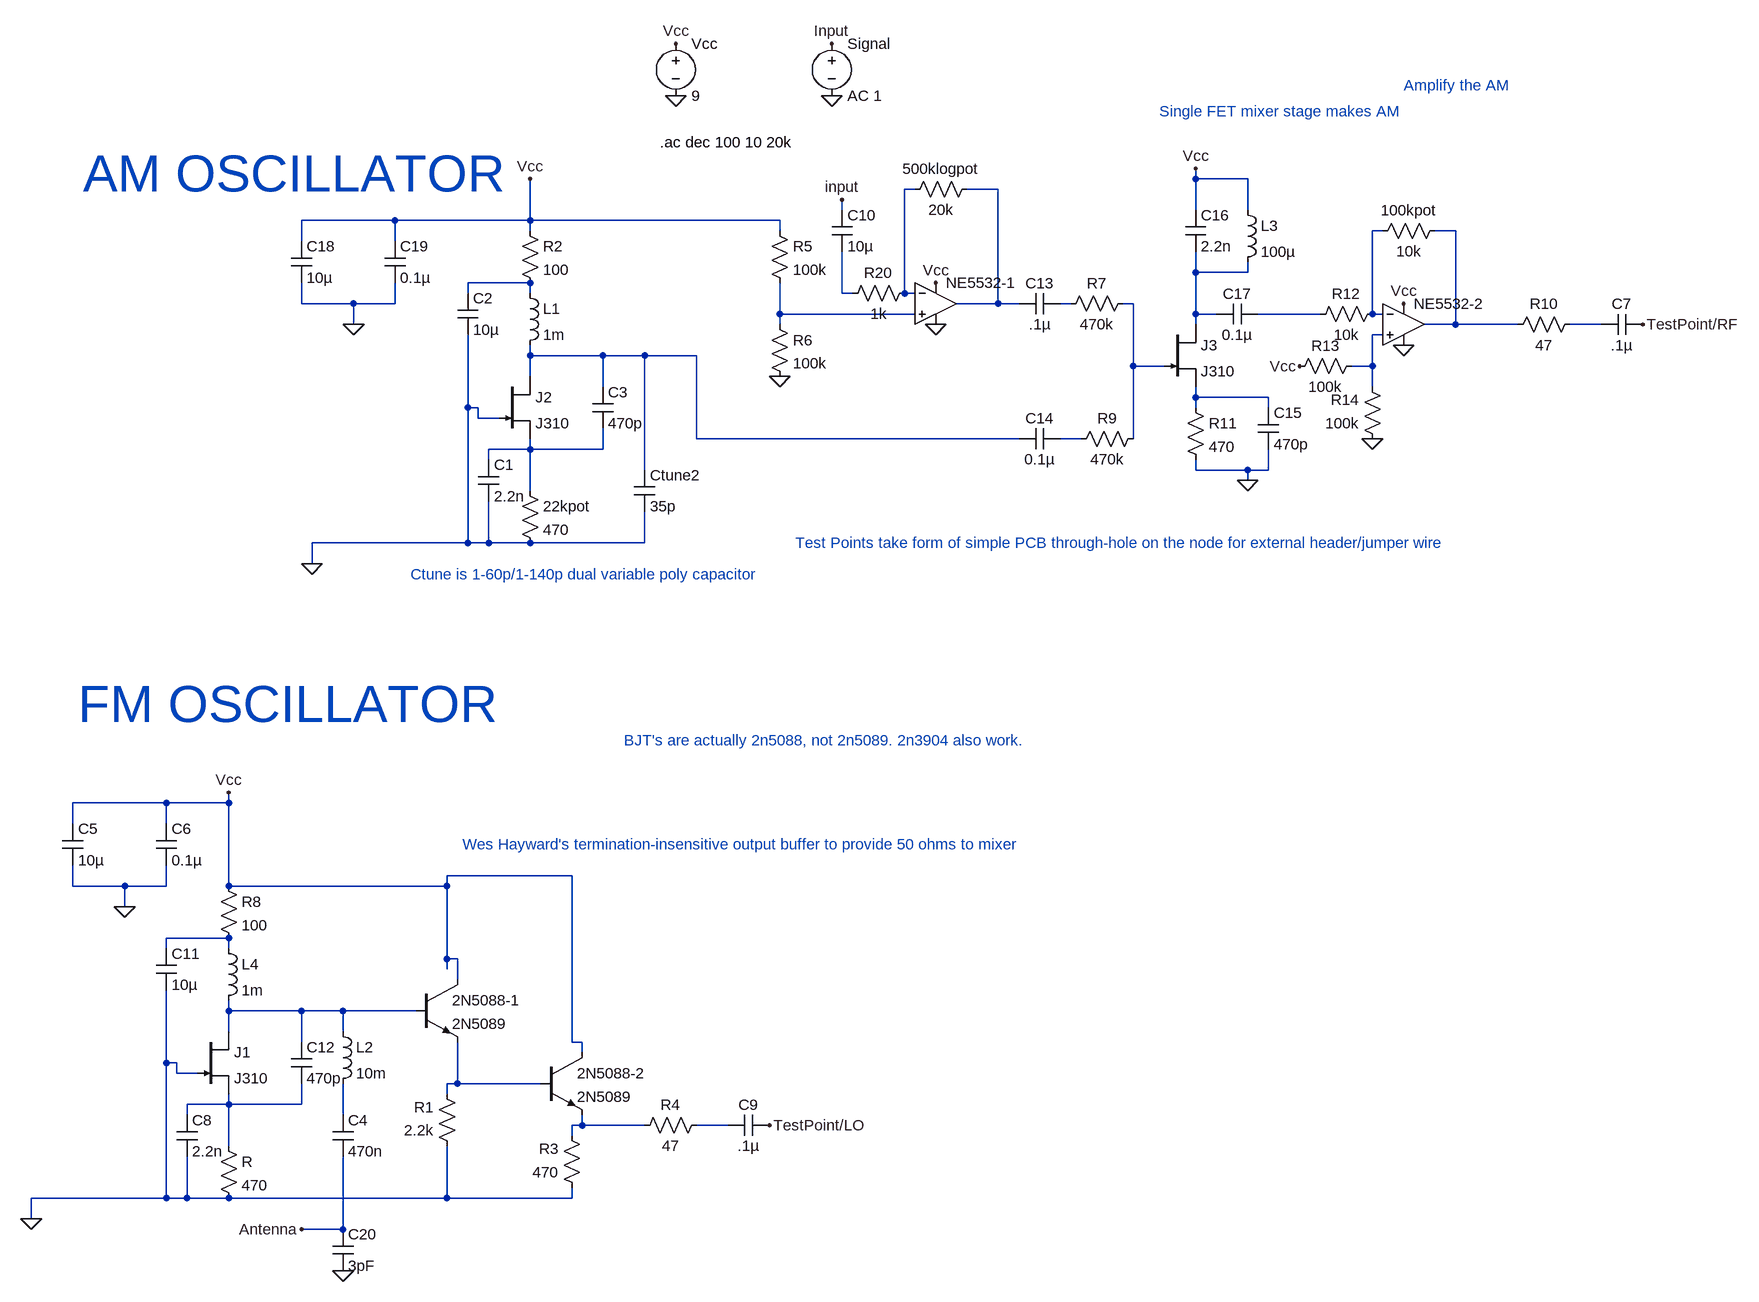
[diagram p0: schematic Theremizer.asc]
Theremizer.asc, the LTspice schematic file:
Version 4
SHEET 1 1160 2132
WIRE -256 -176 -256 -192
WIRE -176 -176 -256 -176
WIRE -688 -160 -704 -160
WIRE -560 -160 -608 -160
WIRE -800 -128 -800 -144
WIRE -256 -128 -256 -176
WIRE -176 -128 -176 -176
WIRE -1488 -112 -1632 -112
WIRE -1280 -112 -1280 -176
WIRE -1280 -112 -1488 -112
WIRE -896 -112 -1280 -112
WIRE -1280 -96 -1280 -112
WIRE -896 -96 -896 -112
WIRE 32 -96 16 -96
WIRE 144 -96 112 -96
WIRE -1632 -80 -1632 -112
WIRE -1488 -80 -1488 -112
WIRE -256 -32 -256 -64
WIRE -176 -32 -176 -48
WIRE -176 -32 -256 -32
WIRE -1280 -16 -1376 -16
WIRE -1376 0 -1376 -16
WIRE -1280 0 -1280 -16
WIRE -800 0 -800 -64
WIRE -784 0 -800 0
WIRE -704 0 -704 -160
WIRE -688 0 -704 0
WIRE -1632 16 -1632 -16
WIRE -1552 16 -1632 16
WIRE -1488 16 -1488 -16
WIRE -1488 16 -1552 16
WIRE -560 16 -560 -160
WIRE -560 16 -624 16
WIRE -528 16 -560 16
WIRE -448 16 -464 16
WIRE -352 16 -368 16
WIRE -896 32 -896 -16
WIRE -688 32 -896 32
WIRE -256 32 -256 -32
WIRE -224 32 -256 32
WIRE -64 32 -160 32
WIRE 16 32 16 -96
WIRE 32 32 16 32
WIRE -1552 48 -1552 16
WIRE -896 48 -896 32
WIRE -256 48 -256 32
WIRE 144 48 144 -96
WIRE 144 48 96 48
WIRE 240 48 144 48
WIRE 368 48 320 48
WIRE 32 64 16 64
WIRE -1280 96 -1280 80
WIRE -1168 96 -1280 96
WIRE -1104 96 -1168 96
WIRE -1024 96 -1104 96
WIRE -352 112 -352 16
WIRE -304 112 -352 112
WIRE 16 112 16 64
WIRE 16 112 -16 112
WIRE -1280 128 -1280 96
WIRE -1168 144 -1168 96
WIRE 16 144 16 112
WIRE -256 160 -256 144
WIRE -144 160 -256 160
WIRE -1376 176 -1376 64
WIRE -1360 176 -1376 176
WIRE -256 176 -256 160
WIRE -144 176 -144 160
WIRE -1360 192 -1360 176
WIRE -1328 192 -1360 192
WIRE -1024 224 -1024 96
WIRE -528 224 -1024 224
WIRE -432 224 -464 224
WIRE -352 224 -352 112
WIRE -1280 240 -1280 224
WIRE -1280 240 -1344 240
WIRE -1168 240 -1168 208
WIRE -1168 240 -1280 240
WIRE -1344 256 -1344 240
WIRE -1104 272 -1104 96
WIRE -256 272 -256 256
WIRE -176 272 -256 272
WIRE -144 272 -144 240
WIRE -144 272 -176 272
WIRE -176 288 -176 272
WIRE -1280 304 -1280 240
WIRE -1376 384 -1376 176
WIRE -1376 384 -1616 384
WIRE -1344 384 -1344 320
WIRE -1344 384 -1376 384
WIRE -1280 384 -1344 384
WIRE -1104 384 -1104 336
WIRE -1104 384 -1280 384
WIRE -1616 416 -1616 384
WIRE -1840 784 -1984 784
WIRE -1744 784 -1744 768
WIRE -1744 784 -1840 784
WIRE -1984 816 -1984 784
WIRE -1840 816 -1840 784
WIRE -1216 896 -1408 896
WIRE -1984 912 -1984 880
WIRE -1904 912 -1984 912
WIRE -1840 912 -1840 880
WIRE -1840 912 -1904 912
WIRE -1744 912 -1744 784
WIRE -1408 912 -1408 896
WIRE -1408 912 -1744 912
WIRE -1904 944 -1904 912
WIRE -1744 992 -1840 992
WIRE -1840 1008 -1840 992
WIRE -1744 1008 -1744 992
WIRE -1408 1024 -1408 912
WIRE -1392 1024 -1408 1024
WIRE -1408 1040 -1408 1024
WIRE -1392 1056 -1392 1024
WIRE -1744 1104 -1744 1088
WIRE -1632 1104 -1744 1104
WIRE -1568 1104 -1632 1104
WIRE -1456 1104 -1568 1104
WIRE -1744 1136 -1744 1104
WIRE -1568 1136 -1568 1104
WIRE -1632 1152 -1632 1104
WIRE -1216 1152 -1216 896
WIRE -1200 1152 -1216 1152
WIRE -1200 1168 -1200 1152
WIRE -1840 1184 -1840 1072
WIRE -1824 1184 -1840 1184
WIRE -1824 1200 -1824 1184
WIRE -1792 1200 -1824 1200
WIRE -1392 1216 -1392 1152
WIRE -1392 1216 -1408 1216
WIRE -1264 1216 -1392 1216
WIRE -1408 1232 -1408 1216
WIRE -1744 1248 -1744 1232
WIRE -1744 1248 -1808 1248
WIRE -1632 1248 -1632 1216
WIRE -1632 1248 -1744 1248
WIRE -1808 1264 -1808 1248
WIRE -1568 1264 -1568 1216
WIRE -1200 1280 -1200 1264
WIRE -1200 1280 -1216 1280
WIRE -1104 1280 -1200 1280
WIRE -976 1280 -1024 1280
WIRE -1216 1296 -1216 1280
WIRE -1744 1312 -1744 1248
WIRE -1840 1392 -1840 1184
WIRE -1840 1392 -2048 1392
WIRE -1808 1392 -1808 1328
WIRE -1808 1392 -1840 1392
WIRE -1744 1392 -1808 1392
WIRE -1408 1392 -1408 1312
WIRE -1408 1392 -1744 1392
WIRE -1216 1392 -1216 1376
WIRE -1216 1392 -1408 1392
WIRE -2048 1424 -2048 1392
WIRE -1568 1440 -1568 1328
WIRE -1568 1440 -1632 1440
FLAG -1056 -304 0
FLAG -1056 -384 Vcc
FLAG -1632 1440 Antenna
FLAG -1280 -176 Vcc
FLAG -816 -304 0
FLAG -816 -384 Input
FLAG -2048 1424 0
FLAG -1744 768 Vcc
FLAG -1616 416 0
FLAG -1904 944 0
FLAG 432 48 TestPoint/RF
FLAG -896 128 0
FLAG -656 48 0
FLAG -656 -16 Vcc
FLAG -800 -144 input
FLAG -176 288 0
FLAG -256 -192 Vcc
FLAG 64 80 0
FLAG 64 16 Vcc
FLAG 16 224 0
FLAG -96 112 Vcc
FLAG -912 1280 TestPoint/LO
FLAG -1552 48 0
FLAG -1568 1504 0
SYMBOL voltage -1056 -400 R0
WINDOW 123 0 0 Left 0
WINDOW 39 0 0 Left 0
SYMATTR InstName Vcc
SYMATTR Value 9
SYMBOL ind -1584 1120 R0
SYMATTR InstName L2
SYMATTR Value 10m
SYMBOL cap -1584 1264 R0
SYMATTR InstName C4
SYMATTR Value 470n
SYMBOL res -1760 1296 R0
SYMATTR InstName R
SYMATTR Value 470
SYMBOL cap -1824 1264 R0
SYMATTR InstName C8
SYMATTR Value 2.2n
SYMBOL voltage -816 -400 R0
WINDOW 123 0 0 Left 0
WINDOW 39 0 0 Left 0
SYMATTR InstName Signal
SYMATTR Value AC 1
SYMBOL cap -1856 1008 R0
SYMATTR InstName C11
SYMATTR Value 10µ
SYMBOL njf -1792 1136 R0
SYMATTR InstName J1
SYMATTR Value J310
SYMBOL ind -1760 992 R0
SYMATTR InstName L4
SYMATTR Value 1m
SYMBOL res -1760 896 R0
SYMATTR InstName R8
SYMATTR Value 100
SYMBOL cap -1648 1152 R0
SYMATTR InstName C12
SYMATTR Value 470p
SYMBOL res -1296 288 R0
SYMATTR InstName 22kpot
SYMATTR Value 470
SYMBOL cap -1360 256 R0
SYMATTR InstName C1
SYMATTR Value 2.2n
SYMBOL cap -1392 0 R0
SYMATTR InstName C2
SYMATTR Value 10µ
SYMBOL njf -1328 128 R0
SYMATTR InstName J2
SYMATTR Value J310
SYMBOL ind -1296 -16 R0
SYMATTR InstName L1
SYMATTR Value 1m
SYMBOL res -1296 -112 R0
SYMATTR InstName R2
SYMATTR Value 100
SYMBOL cap -1184 144 R0
SYMATTR InstName C3
SYMATTR Value 470p
SYMBOL cap -1120 272 R0
SYMATTR InstName Ctune2
SYMATTR Value 35p
SYMBOL res 224 64 R270
WINDOW 0 32 56 VTop 2
WINDOW 3 0 56 VBottom 2
SYMATTR InstName R10
SYMATTR Value 47
SYMBOL cap -2000 816 R0
SYMATTR InstName C5
SYMATTR Value 10µ
SYMBOL cap -1856 816 R0
SYMATTR InstName C6
SYMATTR Value 0.1µ
SYMBOL cap 432 32 R90
WINDOW 0 0 32 VBottom 2
WINDOW 3 32 32 VTop 2
SYMATTR InstName C7
SYMATTR Value .1µ
SYMBOL res -1392 1328 R180
WINDOW 0 36 76 Left 2
WINDOW 3 36 40 Left 2
SYMATTR InstName R1
SYMATTR Value 2.2k
SYMBOL res -1200 1392 R180
WINDOW 0 36 76 Left 2
WINDOW 3 36 40 Left 2
SYMATTR InstName R3
SYMATTR Value 470
SYMBOL res -1120 1296 R270
WINDOW 0 32 56 VTop 2
WINDOW 3 0 56 VBottom 2
SYMATTR InstName R4
SYMATTR Value 47
SYMBOL cap -912 1264 R90
WINDOW 0 0 32 VBottom 2
WINDOW 3 32 32 VTop 2
SYMATTR InstName C9
SYMATTR Value .1µ
SYMBOL npn -1456 1056 R0
SYMATTR InstName 2N5088-1
SYMATTR Value 2N5089
SYMBOL npn -1264 1168 R0
SYMATTR InstName 2N5088-2
SYMATTR Value 2N5089
SYMBOL Opamps\\UniversalOpamp2 -656 16 R0
SYMATTR InstName NE5532-1
SYMBOL res -912 -112 R0
SYMATTR InstName R5
SYMATTR Value 100k
SYMBOL res -912 32 R0
SYMATTR InstName R6
SYMATTR Value 100k
SYMBOL cap -816 -128 R0
SYMATTR InstName C10
SYMATTR Value 10µ
SYMBOL res -592 -176 R90
WINDOW 0 0 56 VBottom 2
WINDOW 3 32 56 VTop 2
SYMATTR InstName 500klogpot
SYMATTR Value 20k
SYMBOL res -688 -16 R90
WINDOW 0 0 56 VBottom 2
WINDOW 3 32 56 VTop 2
SYMATTR InstName R20
SYMATTR Value 1k
SYMBOL cap -464 0 R90
WINDOW 0 0 32 VBottom 2
WINDOW 3 32 32 VTop 2
SYMATTR InstName C13
SYMATTR Value .1µ
SYMBOL res -352 0 R90
WINDOW 0 0 56 VBottom 2
WINDOW 3 32 56 VTop 2
SYMATTR InstName R7
SYMATTR Value 470k
SYMBOL res -336 208 R90
WINDOW 0 0 56 VBottom 2
WINDOW 3 32 56 VTop 2
SYMATTR InstName R9
SYMATTR Value 470k
SYMBOL cap -464 208 R90
WINDOW 0 0 32 VBottom 2
WINDOW 3 32 32 VTop 2
SYMATTR InstName C14
SYMATTR Value 0.1µ
SYMBOL njf -304 48 R0
SYMATTR InstName J3
SYMATTR Value J310
SYMBOL res -272 160 R0
SYMATTR InstName R11
SYMATTR Value 470
SYMBOL cap -160 176 R0
SYMATTR InstName C15
SYMATTR Value 470p
SYMBOL cap -272 -128 R0
SYMATTR InstName C16
SYMATTR Value 2.2n
SYMBOL ind -192 -144 R0
SYMATTR InstName L3
SYMATTR Value 100µ
SYMBOL res 32 16 R90
WINDOW 0 0 56 VBottom 2
WINDOW 3 32 56 VTop 2
SYMATTR InstName R12
SYMATTR Value 10k
SYMBOL Opamps\\UniversalOpamp2 64 48 R0
SYMATTR InstName NE5532-2
SYMBOL res 0 96 R90
WINDOW 0 0 56 VBottom 2
WINDOW 3 32 56 VTop 2
SYMATTR InstName R13
SYMATTR Value 100k
SYMBOL res 32 240 R180
WINDOW 0 36 76 Left 2
WINDOW 3 36 40 Left 2
SYMATTR InstName R14
SYMATTR Value 100k
SYMBOL res 128 -112 R90
WINDOW 0 0 56 VBottom 2
WINDOW 3 32 56 VTop 2
SYMATTR InstName 100kpot
SYMATTR Value 10k
SYMBOL cap -160 16 R90
WINDOW 0 0 32 VBottom 2
WINDOW 3 32 32 VTop 2
SYMATTR InstName C17
SYMATTR Value 0.1µ
SYMBOL cap -1648 -80 R0
SYMATTR InstName C18
SYMATTR Value 10µ
SYMBOL cap -1504 -80 R0
SYMATTR InstName C19
SYMATTR Value 0.1µ
SYMBOL cap -1584 1440 R0
SYMATTR InstName C20
SYMATTR Value 3pF
TEXT -1080 -232 Left 2 !.ac dec 100 10 20k
TEXT -1968 -184 Left 6 ;AM OSCILLATOR
TEXT -1976 632 Left 6 ;FM OSCILLATOR
TEXT -1384 848 Left 2 ;Wes Hayward's termination-insensitive output buffer to provide 50 ohms to mixer
TEXT -1136 688 Left 2 ;BJT's are actually 2n5088, not 2n5089. 2n3904 also work.
TEXT -312 -280 Left 2 ;Single FET mixer stage makes AM
TEXT 64 -320 Left 2 ;Amplify the AM
TEXT -872 384 Left 2 ;Test Points take form of simple PCB through-hole on the node for external header/jumper wire
TEXT -1464 432 Left 2 ;Ctune is 1-60p/1-140p dual variable poly capacitor

The netlist it stands for:
* Theremizer.asc
Vcc Vcc 0 9
L2 N019 N022 10m
C4 N022 Antenna 470n
R N021 0 470
C8 N021 0 2.2n
V§Signal Input 0 AC 1
C11 N018 0 10µ
J1 N019 0 N021 J310
L4 N018 N019 1m
R8 Vcc N018 100
C12 N019 N021 470p
R§22kpot N017 0 470
C1 N017 0 2.2n
C2 N006 0 10µ
J2 N014 0 N017 J310
L1 N006 N014 1m
R2 Vcc N006 100
C3 N014 N017 470p
Ctune2 N014 0 35p
R10 N004 N012 47
C5 Vcc 0 10µ
C6 Vcc 0 0.1µ
C7 TestPoint/RF N012 .1µ
R1 0 N020 2.2k
R3 0 N023 470
R4 N023 N024 47
C9 TestPoint/LO N024 .1µ
Q§2N5088-1 Vcc N019 N020 0 2N5089
Q§2N5088-2 Vcc N020 N023 0 2N5089
XNE5532-1 N010 N001 Vcc 0 N002 level.2 Avol=1Meg GBW=10Meg Slew=10Meg ilimit=25m rail=0 Vos=0 phimargin=45 en=0 enk=0 in=0 ink=0 Rin=500Meg  ; pins IN+ IN- V+ V- OUT
R5 Vcc N010 100k
R6 N010 0 100k
C10 Input N007 10µ
R§500klogpot N002 N001 20k
R20 N001 N007 1k
C13 N008 N002 .1µ
R7 N009 N008 470k
R9 N009 N016 470k
C14 N016 N014 0.1µ
J3 N005 N009 N015 J310
R11 N015 0 470
C15 N015 0 470p
C16 Vcc N005 2.2n
L3 Vcc N005 100µ
R12 N003 N011 10k
XNE5532-2 N013 N003 Vcc 0 N004 level.2 Avol=1Meg GBW=10Meg Slew=10Meg ilimit=25m rail=0 Vos=0 phimargin=45 en=0 enk=0 in=0 ink=0 Rin=500Meg  ; pins IN+ IN- V+ V- OUT
R13 N013 Vcc 100k
R14 0 N013 100k
R§100kpot N004 N003 10k
C17 N011 N005 0.1µ
C18 Vcc 0 10µ
C19 Vcc 0 0.1µ
C20 Antenna 0 3pF
.model NPN NPN
.model PNP PNP
.lib standard.bjt
.model NJF NJF
.model PJF PJF
.lib standard.jft
.ac dec 100 10 20k
* AM OSCILLATOR
* FM OSCILLATOR
* Wes Hayward's termination-insensitive output buffer to provide 50 ohms to mixer
* BJT's are actually 2n5088, not 2n5089. 2n3904 also work.
* Single FET mixer stage makes AM
* Amplify the AM
* Test Points take form of simple PCB through-hole on the node for external header/jumper wire
* Ctune is 1-60p/1-140p dual variable poly capacitor
.lib UniversalOpamps2.sub
.backanno
.end